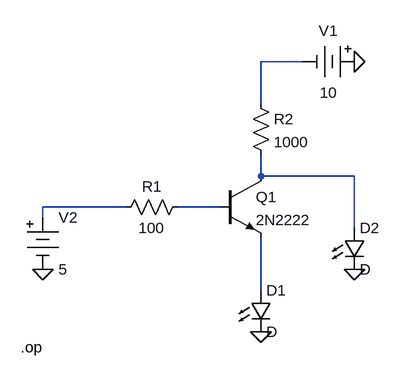
[diagram p0: schematic BJT_Switch.asc]
BJT_Switch.asc, the LTspice schematic file:
Version 4
SHEET 1 880 680
WIRE 384 -96 320 -96
WIRE 320 -32 320 -96
WIRE 320 80 320 48
WIRE 464 80 320 80
WIRE 112 128 -16 128
WIRE 256 128 192 128
WIRE -16 144 -16 128
WIRE 464 160 464 80
WIRE 320 256 320 176
FLAG 464 -96 0
FLAG 464 224 0
FLAG 320 320 0
FLAG -16 224 0
SYMBOL res 208 112 R90
WINDOW 0 0 56 VBottom 2
WINDOW 3 32 56 VTop 2
SYMATTR InstName R1
SYMATTR Value 100
SYMBOL npn 256 80 R0
SYMATTR InstName Q1
SYMATTR Value 2N2222
SYMBOL res 304 -48 R0
SYMATTR InstName R2
SYMATTR Value 1000
SYMBOL Misc\\battery 480 -96 R90
WINDOW 0 -32 56 VBottom 2
WINDOW 3 32 56 VTop 2
SYMATTR InstName V1
SYMATTR Value 10
SYMBOL LED 304 256 R0
SYMATTR InstName D1
SYMBOL LED 448 160 R0
SYMATTR InstName D2
SYMBOL Misc\\battery -16 128 R0
SYMATTR InstName V2
SYMATTR Value 5
TEXT -50 344 Left 2 !.op

The netlist it stands for:
* BJT_Switch.asc
R1 N004 N003 100
Q1 N002 N004 N005 0 2N2222
R2 N001 N002 1000
V1 0 N001 10
D1 N005 0 D
D2 N002 0 D
V2 N003 0 5
.model D D
.lib standard.dio
.model NPN NPN
.model PNP PNP
.lib standard.bjt
.op
.backanno
.end